# EAGLE schematic RC_remote (EAGLE 9.6.2)
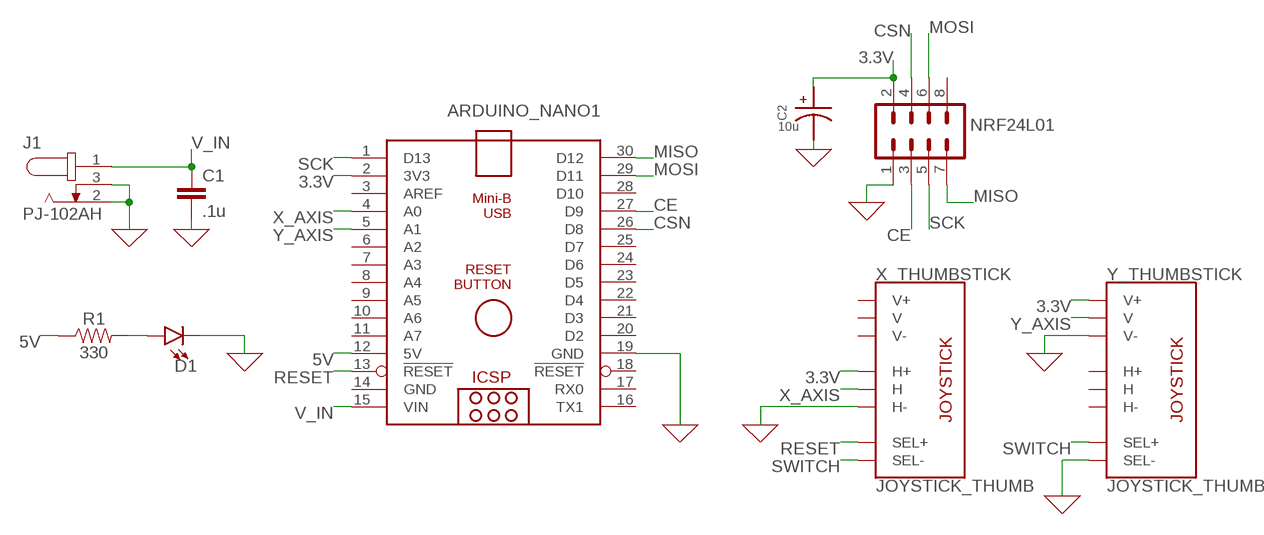
[diagram p0: schematic, sheet 1]

## Parts
ARDUINO_NANO1  ARDUINO_NANO  [ARDUINO_NANO]
C1  .1u  C2,5-3  [C2.5-3]
C2  10u  UVR1E100MDD  [CAPPRD200W50D550H1250]
D1  LED5MM  [LED_5MM]
J1  PJ-102AH  [CUI_PJ-102AH]
NRF24L01  MA04-2  [MA04-2]
R1  330  RESISTORAXIAL-0.3  [AXIAL-0.3]
X_THUMBSTICK  JOYSTICK_THUMB  [JOYSTICK]
Y_THUMBSTICK  JOYSTICK_THUMB  [JOYSTICK]

## Nets
0: ARDUINO_NANO1.19(GND) C1.2 C2.2 D1.K(C) J1.2 J1.3 NRF24L01.1 X_THUMBSTICK.H3(H-) Y_THUMBSTICK.B2A(SEL-) Y_THUMBSTICK.V3(V-) ; supply symbol labelled GND
3.3V: ARDUINO_NANO1.2(3V3) C2.1 NRF24L01.2 X_THUMBSTICK.H1(H+) Y_THUMBSTICK.V1(V+)
5V: ARDUINO_NANO1.12(5V) R1.P$1
CE: ARDUINO_NANO1.27(D9) NRF24L01.3
CSN: ARDUINO_NANO1.26(D8) NRF24L01.4
MISO: ARDUINO_NANO1.30(D12) NRF24L01.7
MOSI: ARDUINO_NANO1.29(D11) NRF24L01.6
N$1: D1.A R1.P$2
RESET: ARDUINO_NANO1.13(!RESET) X_THUMBSTICK.B1A(SEL+)
SCK: ARDUINO_NANO1.1(D13) NRF24L01.5
SWITCH: X_THUMBSTICK.B2A(SEL-) Y_THUMBSTICK.B1A(SEL+)
V_IN: ARDUINO_NANO1.15(VIN) C1.1 J1.1
X_AXIS: ARDUINO_NANO1.4(A0) X_THUMBSTICK.H2(H)
Y_AXIS: ARDUINO_NANO1.5(A1) Y_THUMBSTICK.V2(V)
Unconnected: ARDUINO_NANO1.3(AREF) ARDUINO_NANO1.6(A2) ARDUINO_NANO1.7(A3) ARDUINO_NANO1.8(A4) ARDUINO_NANO1.9(A5) ARDUINO_NANO1.10(A6) ARDUINO_NANO1.11(A7) ARDUINO_NANO1.16(TX1) ARDUINO_NANO1.17(RX0) ARDUINO_NANO1.18(!RESET) ARDUINO_NANO1.20(D2) ARDUINO_NANO1.21(D3) ARDUINO_NANO1.22(D4) ARDUINO_NANO1.23(D5) ARDUINO_NANO1.24(D6) ARDUINO_NANO1.25(D7) ARDUINO_NANO1.28(D10) NRF24L01.8 X_THUMBSTICK.V1(V+) X_THUMBSTICK.V2(V) X_THUMBSTICK.V3(V-) Y_THUMBSTICK.H1(H+) Y_THUMBSTICK.H2(H) Y_THUMBSTICK.H3(H-)

## Power pins joined to a net without a drawn wire
GND: ARDUINO_NANO1.14(GND)

## Library data of the parts
ARDUINO_NANO1 = ArduinoNano:ARDUINO_NANO: Arduino Nano V3.0 Overview: The Arduino Nano is a small, complete, and breadboard-friendly board based on the ATmega328 (Arduino Nano 3.x) or ATmega168 (Arduino Nano 2.x). It has more or less the same functionality of the Arduino Duemilanove, but in a different package. It lacks only a DC power jack, and works with a Mini-B USB cable instead of a standard one. The Nano was designed and is being produced by Gravitech. Specifications: Microcontroller Atmel ATmega168 or ATmega328 Operating Voltage (logic level) 5 V Input Voltage (recommended) 7-12 V Input Voltage (limits) 6-20 V Digital I/O Pins 14 (of which 6 provide PWM output) Analog Input Pins 8 DC Current per I/O Pin 40 mA Flash Memory 16 KB (ATmega168) or 32 KB (ATmega328) of which 2 KB used by bootloader SRAM 1 KB (ATmega168) or 2 KB (ATmega328) EEPROM 512 bytes (ATmega168) or 1 KB (ATmega328) Clock Speed 16 MHz Dimensions 0.73" x 1.70" Length 45 mm Width 18 mm Weigth 5 g Power: The Arduino Nano can be powered via the Mini-B USB connection, 6-20V unregulated external power supply (pin 30), or 5V regulated external power supply (pin 27). The power source is automatically selected to the highest voltage source. Memory: The ATmega168 has 16 KB of flash memory for storing code (of which 2 KB is used for the bootloader); the ATmega328 has 32 KB, (also with 2 KB used for the bootloader). The ATmega168 has 1 KB of SRAM and 512 bytes of EEPROM (which can be read and written with the EEPROM library); the ATmega328 has 2 KB of SRAM and 1 KB of EEPROM. Input and Output: Each of the 14 digital pins on the Nano can be used as an input or output, using pinMode(), digitalWrite(), and digitalRead() functions. They operate at 5 volts. Each pin can provide or receive a maximum of 40 mA and has an internal pull-up resistor (disconnected by default) of 20-50 kOhms. In addition, some pins have specialized functions. Visit Arduino - ArduinoBoardNano <https://www.arduino.cc/en/Main/ArduinoBoardNano>
C1 = capacitor-wima:C: CAPACITOR naming: grid - package width
C2 = UVR1E100MDD:UVR1E100MDD: 0.47µF 100V Aluminum Electrolytic Capacitors Radial, Can 2000 Hrs @ 85°C; DESCRIPTION: 10 µF 25 V Aluminum Electrolytic Capacitors Radial, Can - 2000 Hrs @ 85°C; DIGI-KEY_PART_NUMBER: UVR1E100MDD1TA-ND; MF: Nichicon; MP: UVR1E100MDD; PACKAGE: Radial Nichicon; PURCHASE-URL: https://pricing.snapeda.com/search/part/UVR1E100MDD/?ref=eda
D1 = SparkFun-LED:LED: LED (Generic) Standard schematic elements and footprints for 5mm, 3mm, 1206, and 0603 sized LEDs. Generic LEDs with no color specified.
J1 = PJ-102AH:PJ-102AH: 2.0 mm Center Pin, 5.0 A, Right Angle, Through Hole, Tapered Pins, Dc Power Jack Connector Check prices <https://pricing.snapeda.com/parts/PJ-102AH/CUI%20Devices/view-part?ref=eda>; AVAILABILITY: In Stock; CUI_PURCHASE_URL: https://www.cuidevices.com/product/interconnect/connectors/dc-power-connectors/jacks/pj-102ah?utm_source=snapeda.com&utm_medium=referral&utm_campaign=snapedaBOM; DESCRIPTION: 2.0 x 6.5 mm, 5.0 A, Horizontal, Through Hole, Tapered Pins, Dc Power Jack Connector; MF: CUI Devices; MP: PJ-102AH; PACKAGE: None; PRICE: None; PURCHASE-URL: https://pricing.snapeda.com/search/part/PJ-102AH/?ref=eda
NRF24L01 = con-lstb:MA04-2: PIN HEADER; OC_FARNELL: unknown; OC_NEWARK: unknown
R1 = SparkFun-Resistors:RESISTOR: Generic Resistor Package
X_THUMBSTICK Y_THUMBSTICK = SparkFun-Switches:JOYSTICK_THUMB: Analog Thumb Joystick This is a joystick very similar to the ‘analog’ joysticks on PS2 (PlayStation 2) controllers. Directional movements are simply two potentiometers - one for each axis. Pots are ~10k each. This joystick also has a select button that is actuated when the joystick is pressed down. SparkFun Products Thumb Joystick <https://www.sparkfun.com/products/9032> (COM-09032) SparkFun Thumb Joystick Breakout <https://www.sparkfun.com/products/9110> (BOB-09110) SparkFun Joystick Shield Kit <https://www.sparkfun.com/products/9760> (DEV-09760); PROD_ID: COMP-09744; SF_SKU: COM-09032